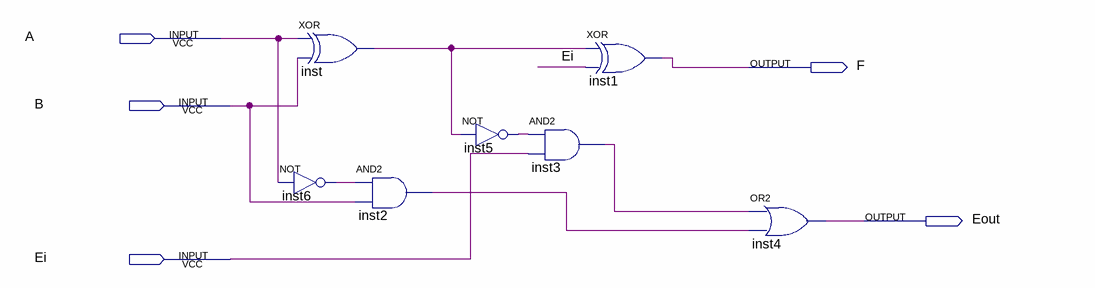
[diagram p0: schematic sheet]
// Quartus schematic SUB1.bdf as structural Verilog: 7 symbols, 5 pins
module SUB1 (
  input  A,
  input  B,
  input  Ei,
  output F,
  output Eout
);

  wire inst2_out, inst3_out, inst5_out, inst6_out, inst_out;

  xor inst (inst_out, A, B);
  not inst6 (inst6_out, A);
  and inst2 (inst2_out, inst6_out, B);
  and inst3 (inst3_out, inst5_out, Ei);
  not inst5 (inst5_out, inst_out);
  xor inst1 (F, inst_out, Ei);
  or inst4 (Eout, inst3_out, inst2_out);
endmodule
